# Altium schematic sheet [1]Root.SchDoc
size A3; SheetNumber: 1; SheetTotal: 5
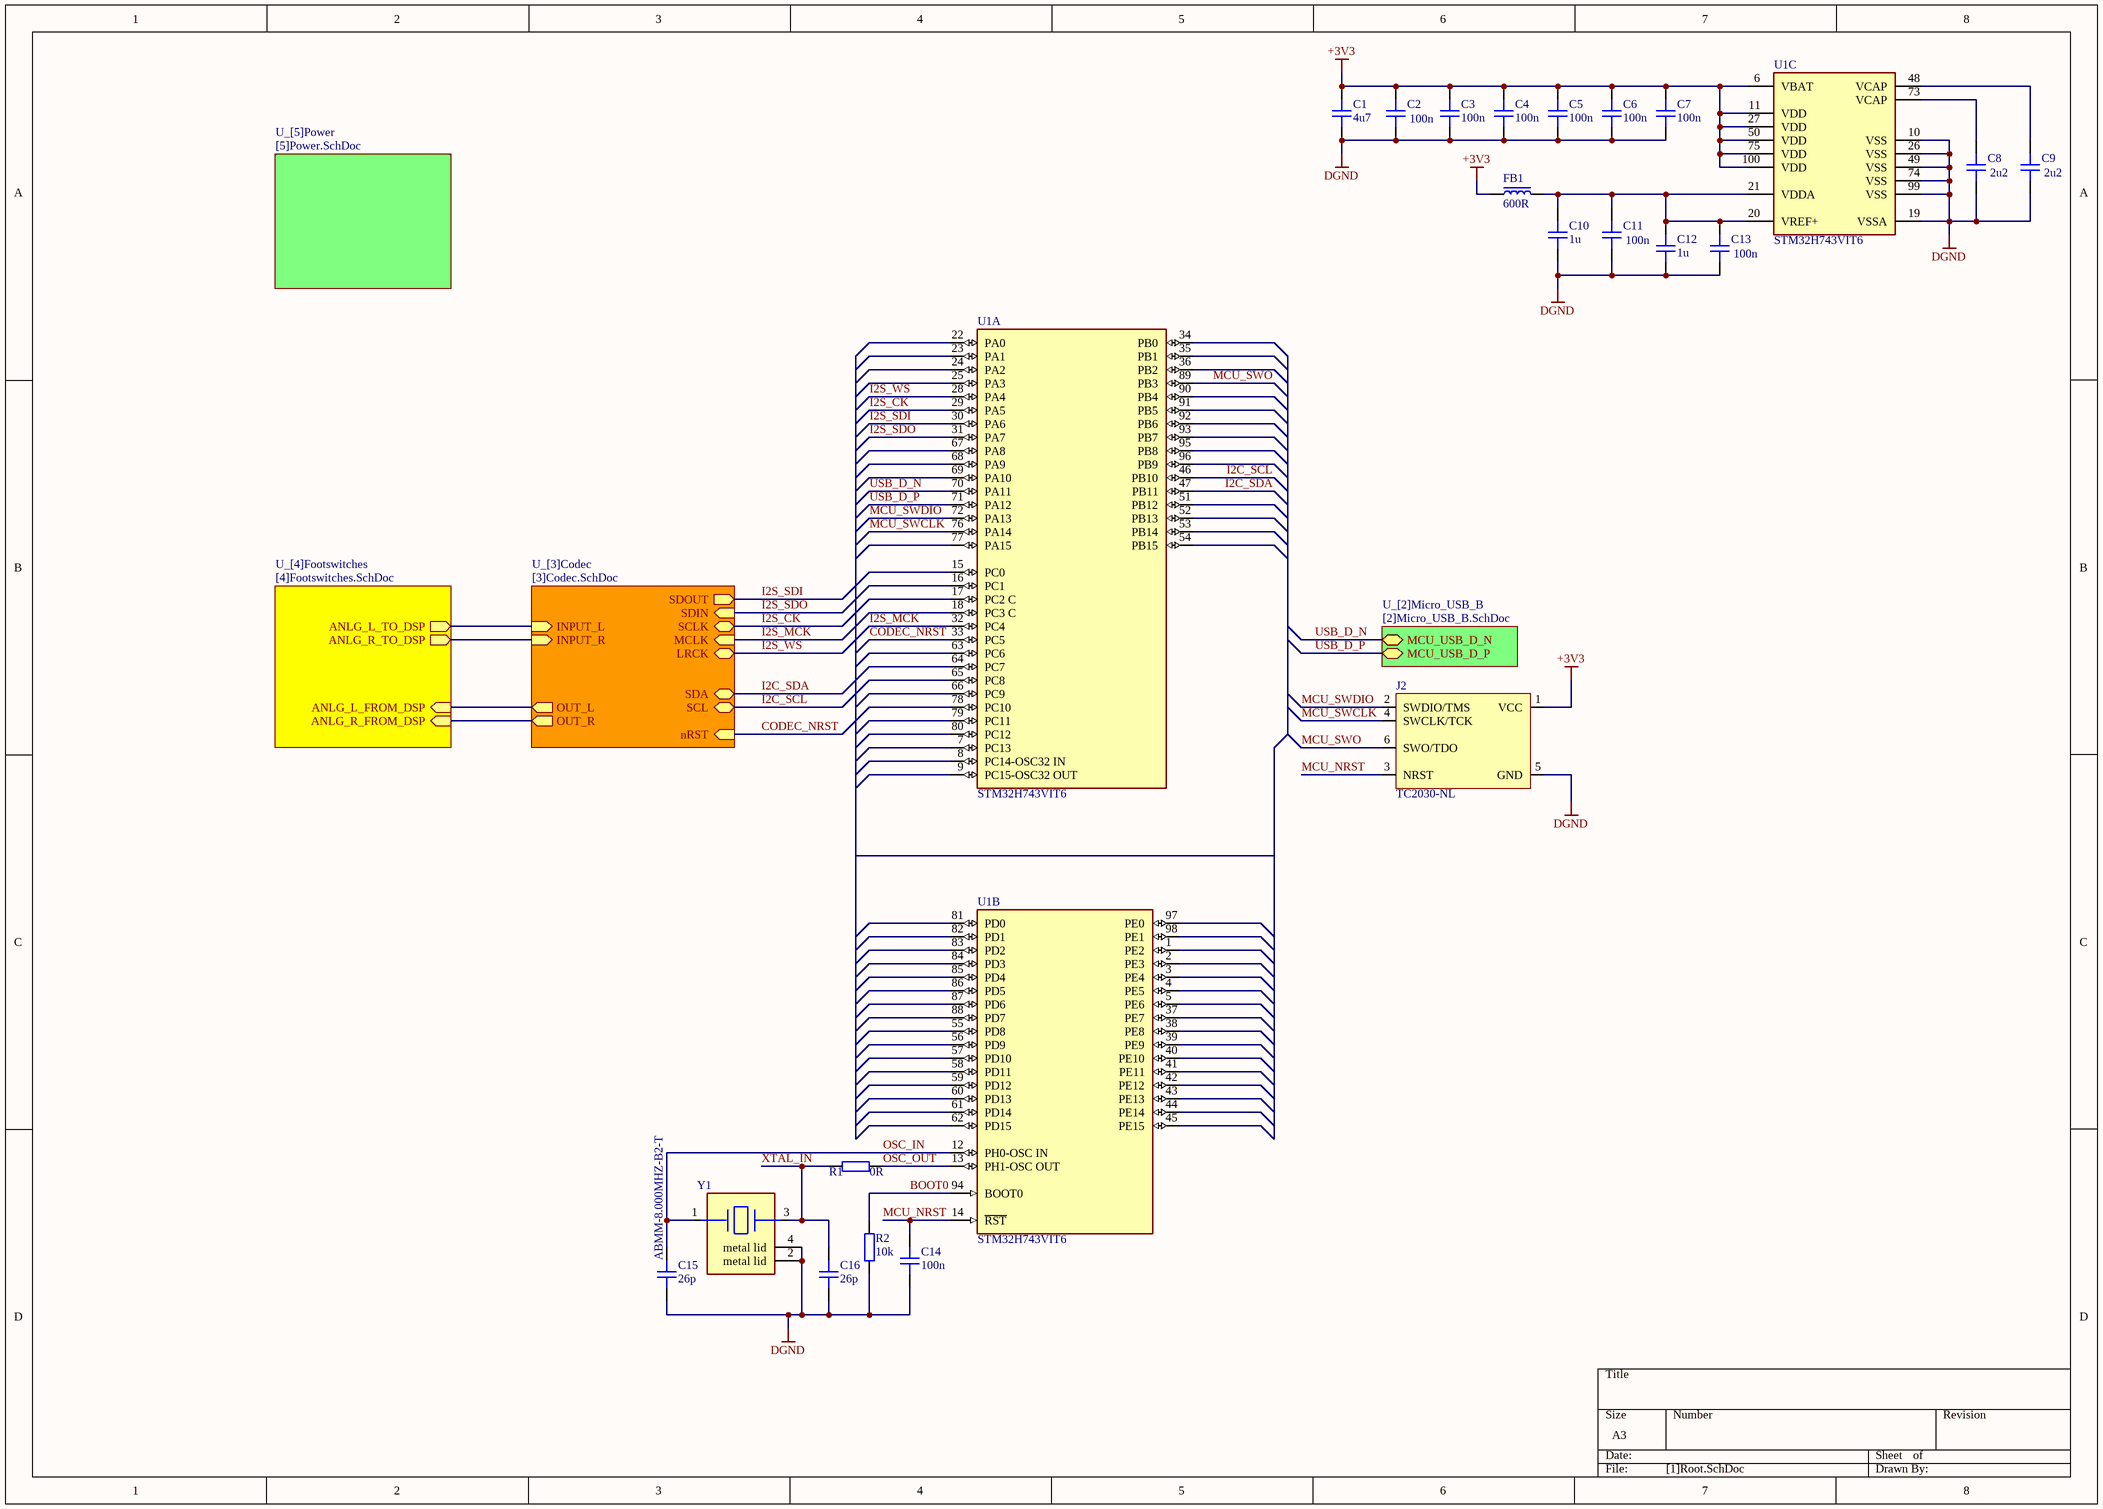
[diagram p0: [1]Root.SchDoc]

## Parts
C1  4u7  [CAP_0603]
C2  100n  [CAP_0402]
C3  100n  [CAP_0402]
C4  100n  [CAP_0402]
C5  100n  [CAP_0402]
C6  100n  [CAP_0402]
C7  100n  [CAP_0402]
C8  2u2  [CAP_0402]
C9  2u2  [CAP_0402]
C10  1u  [CAP_0603]
C11  100n  [CAP_0402]
C12  1u  [CAP_0603]
C13  100n  [CAP_0402]
C14  100n  [CAP_0402]
C15  26p  [CAP_0402]
C16  26p  [CAP_0402]
FB1  600R  [FB_0805]
J2  TC2030-NL  [TC2030-NL-FP]  (no BOM)
R1  0R  [RES_0402]
R2  10k  [RES_0402]
U1  STM32H743VIT6  [FP-LQFP100-1L-MFG]  (parts A,B,C of 3)
Y1  ABMM-8.000MHZ-B2-T  [FP-ABMM-MFG]

## Sub-sheets
U_[2]Micro_USB_B = [2]Micro_USB_B.SchDoc: MCU_USB_D_N (bidir), MCU_USB_D_P (bidir)
U_[3]Codec = [3]Codec.SchDoc: SDIN (in), SDOUT (out), LRCK (bidir), SCLK (bidir), MCLK (in), SDA (bidir), SCL (bidir), nRST (in), INPUT_L (in), INPUT_R (in), OUT_L (out), OUT_R (out)
U_[4]Footswitches = [4]Footswitches.SchDoc: ANLG_L_TO_DSP (out), ANLG_R_TO_DSP (out), ANLG_L_FROM_DSP (in), ANLG_R_FROM_DSP (in)
U_[5]Power = [5]Power.SchDoc: no entries

## Nets
+3V3: C1.2 C2.2 C3.2 C4.2 C5.2 C6.2 C7.2 FB1.1 J2.1(VCC) U1.6(VBAT) U1.11(VDD) U1.27(VDD) U1.50(VDD) U1.75(VDD) U1.100(VDD)
DGND: C1.1 C2.1 C3.1 C4.1 C5.1 C6.1 C7.1 C8.1 C9.1 C10.1 C11.1 C12.1 C13.1 C14.1 C15.1 C16.1 J2.5(GND) R2.1 U1.10(VSS) U1.19(VSSA) U1.26(VSS) U1.49(VSS) U1.74(VSS) U1.99(VSS) Y1.2(metal_lid) Y1.4(metal_lid)
BOOT0: R2.2 U1.94(BOOT0)
CODEC_NRST: U1.33(PC5) ; sheet U_[3]Codec/nRST
I2C_SCL: U1.46(PB10) ; sheet U_[3]Codec/SCL
I2C_SDA: U1.47(PB11) ; sheet U_[3]Codec/SDA
I2S_CK: U1.29(PA5) ; sheet U_[3]Codec/SCLK
I2S_MCK: U1.32(PC4) ; sheet U_[3]Codec/MCLK
I2S_SDI: U1.30(PA6) ; sheet U_[3]Codec/SDOUT
I2S_SDO: U1.31(PA7) ; sheet U_[3]Codec/SDIN
I2S_WS: U1.28(PA4) ; sheet U_[3]Codec/LRCK
MCU_NRST: C14.2 J2.3(NRST) U1.14(~{RST})
MCU_SWCLK: J2.4(SWCLK/TCK) U1.76(PA14)
MCU_SWDIO: J2.2(SWDIO/TMS) U1.72(PA13)
MCU_SWO: J2.6(SWO/TDO) U1.89(PB3)
OSC_IN: C15.2 U1.12(PH0-OSC_IN) Y1.1
OSC_OUT: R1.2 U1.13(PH1-OSC_OUT)
USB_D_N: U1.70(PA11) ; sheet U_[2]Micro_USB_B/MCU_USB_D_N
USB_D_P: U1.71(PA12) ; sheet U_[2]Micro_USB_B/MCU_USB_D_P
XTAL_IN: C16.2 R1.1 Y1.3
NetC8_2: C8.2 U1.73(VCAP)
NetC9_2: C9.2 U1.48(VCAP)
NetC10_2: C10.2 C11.2 C12.2 C13.2 FB1.2 U1.20(VREF+) U1.21(VDDA)
(unnamed): sheet U_[3]Codec/INPUT_L, sheet U_[4]Footswitches/ANLG_L_TO_DSP
(unnamed): sheet U_[3]Codec/INPUT_R, sheet U_[4]Footswitches/ANLG_R_TO_DSP
(unnamed): sheet U_[3]Codec/OUT_L, sheet U_[4]Footswitches/ANLG_L_FROM_DSP
(unnamed): sheet U_[3]Codec/OUT_R, sheet U_[4]Footswitches/ANLG_R_FROM_DSP

Not connected (* = marked no-connect by the designer): U1 1(PE2) 2(PE3) 3(PE4) 4(PE5) 5(PE6) 7(PC13) 8(PC14-OSC32_IN) 9(PC15-OSC32_OUT) 15(PC0) 16(PC1) 17(PC2_C) 18(PC3_C) 22(PA0) 23(PA1) 24(PA2) 25(PA3) 34(PB0) 35(PB1) 36(PB2) 37(PE7) 38(PE8) 39(PE9) 40(PE10) 41(PE11) 42(PE12) 43(PE13) 44(PE14) 45(PE15) 51(PB12) 52(PB13) 53(PB14) 54(PB15) 55(PD8) 56(PD9) 57(PD10) 58(PD11) 59(PD12) 60(PD13) 61(PD14) 62(PD15) 63(PC6) 64(PC7) 65(PC8) 66(PC9) 67(PA8) 68(PA9) 69(PA10) 77(PA15) 78(PC10) 79(PC11) 80(PC12) 81(PD0) 82(PD1) 83(PD2) 84(PD3) 85(PD4) 86(PD5) 87(PD6) 88(PD7) 90(PB4) 91(PB5) 92(PB6) 93(PB7) 95(PB8) 96(PB9) 97(PE0) 98(PE1)

## Library data of the parts
C1 C10 C12 = CAP_0603: 16V; Manufacturer: *; Manufacturer Part Number: *; Distributor Link: *; LCSC: *; Rating: *; Dielectric: *
C2-C9 C11 C13 C14 = CAP_0402: 16V; Manufacturer: *; Manufacturer Part Number: *; Distributor Link: *; LCSC: *; Rating: *; Dielectric: *
C15 C16 = CAP_0402: Capacitor SMD 0402; Manufacturer: *; Manufacturer Part Number: *; Distributor Link: *; LCSC: *; Rating: *; Dielectric: *
FB1 = FB_0805: 300mOhm DC, 600R @ 100MHz; Manufacturer: *; Manufacturer Part Number: *; Distributor Link: *; LCSC: *
J2 = TC2030-NL: Tag-Connect No-Solder SWD Debug Connector (No Legs) DO NOT PLACE; Manufacturer: Tag-Connect; Manufacturer Part Number: TC2030-NL-FP
R1 R2 = RES_0402: Resistor SMD 0402; Manufacturer: *; Manufacturer Part Number: *; Distributor Link: *; LCSC: *
U1 = CMP-12105-000050-1: IC MCU 32BIT 2MB FLASH 100LQFP; Manufacturer: STMicroelectronics; Number Of Ethernet Channels: 1; Number Of Usb Channels: 2; Number Of A/D Converters: 3; Min Supply Voltage: 1.71V; Ram Size: 1060KBytes; Number Of I2C Channels: 4; Frequency: 480MHz; Number Of Adc Channels: 36; Number Of I/Os: 82; Max Supply Voltage: 3.6V; Number Of Spi Channels: 6; Memory Size: 2MBytes; Max Junction Temp: +125°C; Core Architecture: Arm Cortex-M7; Interface: I2C,SPI,UART,USART,USB,LIN,IrDA,Ethernet,I2S,Other; Number Of Timers/Counters: 20; Data Bus Width: 32bits; Number Of Pwm Channels: 42; Number Of Uart Channels: 9; Standoff Height: 0.05mm; Device Class L1: Integrated Circuits (ICs); ComponentLink2URL: https://www.st.com/resource/en/datasheet/stm32h743vi.pdf; Automotive: No; Memory Type: FLASH; Number Of Cores: 1; Temperature Range Low: -40°C; RoHS: TRUE; Ambient Temperature Range Low: -40°C; ComponentLink2Description: Datasheet; Device Class L2: Embedded Processors and Controllers; Device Class L3: Microcontrollers; Digikey Description: IC MCU 32BIT 2MB FLASH 100LQFP; Temperature Range High: +125°C; Ambient Temperature Range High: +85°C; Package: LQFP100-1L; Temperature: -40°C to +125°C; Category: IC; Ipc Land Pattern Name: QFP50P1600X1600X160-100; Height: 1.6mm; Manufacturer Part Number: STM32H743VIT6; Octopart: https://octopart.com/stm32h743vit6-stmicroelectronics-76372527; Lead Free: Yes
Y1 = CMP-27762-006043-1: CRYSTAL 8.0000MHZ 18PF SMD; Tolerance: 20ppm; Frequency: 8MHz; Frequency Stability: 50ppm; Operating Frequency: 8 MHz; ESR (Equivalent Series Resistance): 70R; Package Quantity: 1000; Number of Pins: 4; Mount: Surface Mount; Accuracy: 20ppm; Depth: 5.2mm; Resistor Type: Ceramic; Lead Free: Lead Free; Series: ABMM; Packaging: Tape and Reel; Length: 7.2mm; REACH SVHC: No SVHC; Termination: SMD/SMT; Load Capacitance: 18pF; Case/Package: CSMD; Width: 0.197inch; Max Operating Temperature: 70°C; Radiation Hardening: No; Series Resistance: 70R; Frequency Tolerance: 20ppm; Min Operating Temperature: -20°C; Height: 0.051inch